# Altium schematic sheet Control.SchDoc
size A4; SheetNumber: 2; SheetTotal: 2
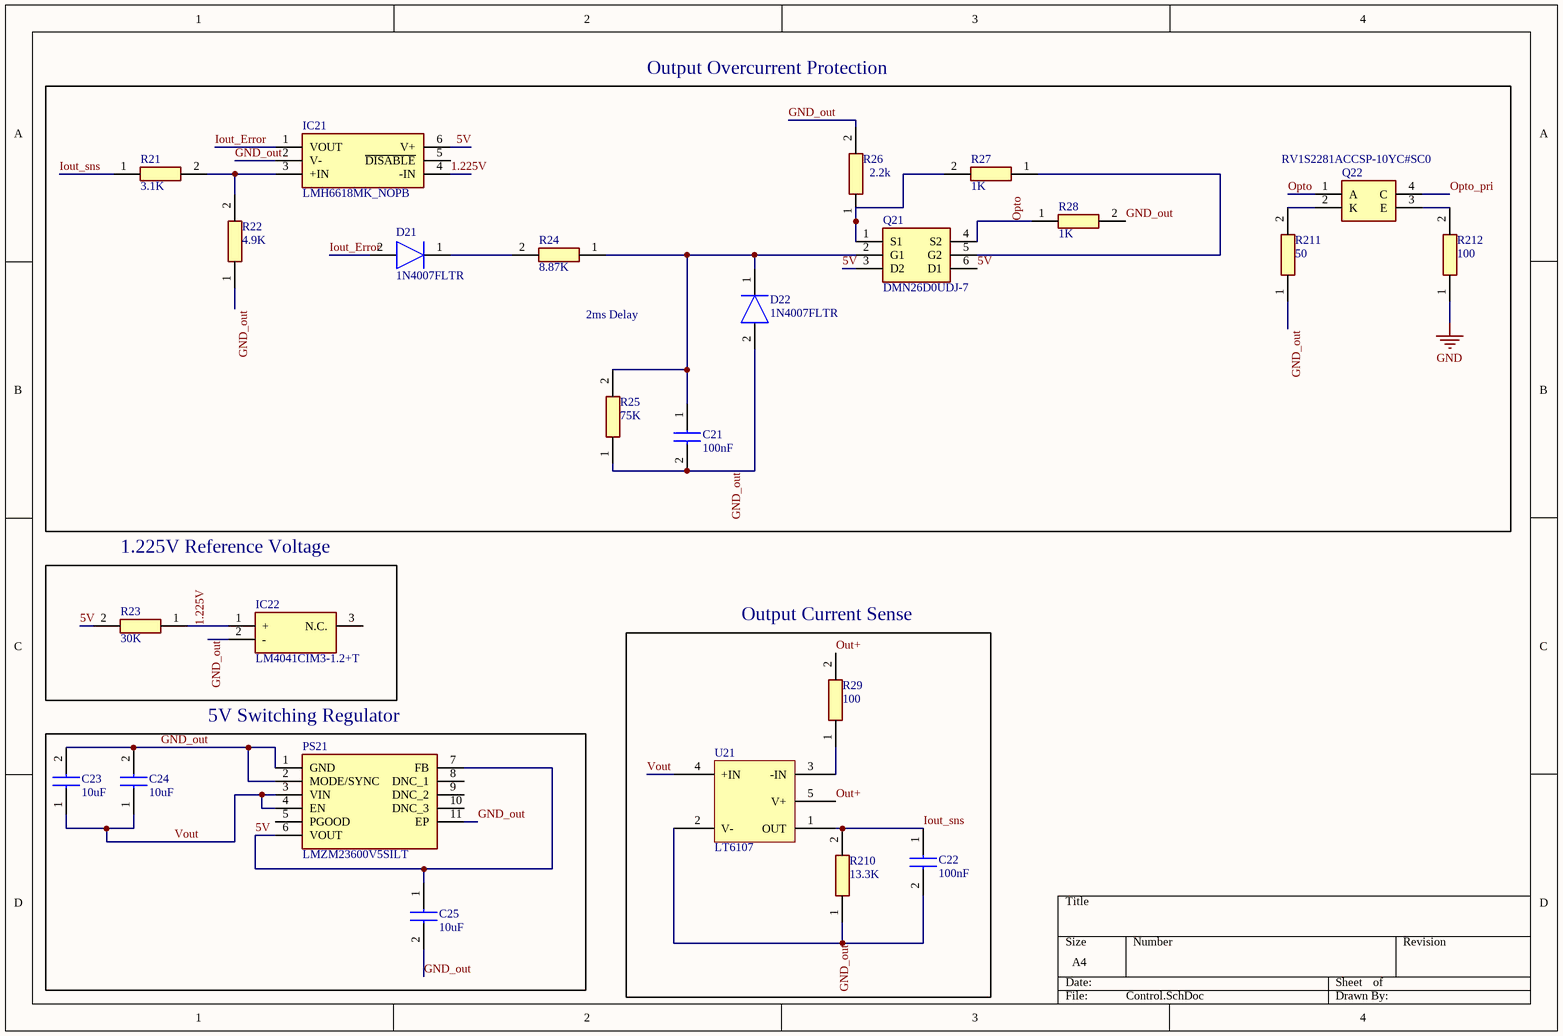
[diagram p0: Control.SchDoc]

## Parts
C21  100nF  [CAPC1005X55N]
C22  100nF  [CAPC1005X55N]
C23  10uF  [CAPC2012X145N]
C24  10uF  [CAPC2012X145N]
C25  10uF  [CAPC2012X145N]
D21  1N4007FLTR  [SODFL3718X140N]
D22  1N4007FLTR  [SODFL3718X140N]
IC21  LMH6618MK_NOPB  [SOT95P280X110-6N]
IC22  LM4041CIM3-1.2+T  [SOT95P237X112-3N]
PS21  LMZM23600V5SILT  [LMZM23600SILT]
Q21  DMN26D0UDJ-7  [SOTFL35P100X50-6N]
Q22  RV1S2281ACCSP-10YC#SC0  [SOP130P1020X210-4N]
R21  3.1K  [ERJ2RKD1004X]
R22  4.9K  [ERJ2RKD1004X]
R23  30K  [ERJ2RKD1004X]
R24  8.87K  [ERJ2RKD1004X]
R25  75K  [ERJ2RKD1004X]
R26  2.2k  [ERJ2RKD1004X]
R27  1K  [ERJ2RKD1004X]
R28  1K  [ERJ2RKD1004X]
R29  100  [ERJ2RKD1004X]
R210  13.3K  [ERJ2RKD1004X]
R211  50  [ERJ2RKD1004X]
R212  100  [ERJ2RKD1004X]
U21  LT6107  [SOT95P245X110-5N]

## Blocks framed on the sheet
Output Overcurrent Protection: C21 D21 D22 IC21 Q21 Q22 R21 R22 R24-R28 R211 R212
1.225V Reference Voltage: IC22 R23
Output Current Sense: C22 R29 R210 U21
5V Switching Regulator: C23-C25 PS21

## Nets
GND: R212.1
1.225V: IC21.4(-IN) IC22.1(+) R23.1
5V: C25.1 IC21.6(V+) PS21.6(VOUT) PS21.7(FB) Q21.3(D2) Q21.6(D1) R23.2
GND_out: C21.2 C22.2 C23.2 C24.2 C25.2 D22.2(A) IC21.2(V-) IC22.2(-) PS21.1(GND) PS21.2(MODE/SYNC) PS21.11(EP) R22.1 R25.1 R26.2 R28.2 R210.1 R211.1 U21.2(V-)
Iout_Error: D21.2(A) IC21.1(VOUT)
Iout_sns: C22.1 R21.1 R210.2 U21.1(OUT)
Opto: Q21.4(S2) Q22.1(A) R28.1
Opto_pri: Q22.4(C)
Out+: R29.2 U21.5(V+)
Vout: C23.1 C24.1 PS21.3(VIN) PS21.4(EN) U21.4(+IN)
NetC21_1: C21.1 D22.1(K) Q21.2(G1) R24.1 R25.2
NetD21_1: D21.1(K) R24.2
NetIC21_3: IC21.3(+IN) R21.2 R22.2
NetQ21_1: Q21.1(S1) R26.1 R27.2
NetQ21_5: Q21.5(G2) R27.1
NetQ22_2: Q22.2(K) R211.2
NetQ22_3: Q22.3(E) R212.2
NetR29_1: R29.1 U21.3(-IN)

Not connected (* = marked no-connect by the designer): IC21 5(~{DISABLE}); IC22 3(N.C.); PS21 5(PGOOD) 8(DNC_1) 9(DNC_2) 10(DNC_3)

## Notes on the sheet
- 2ms Delay

## Library data of the parts
C21 C22 = C0402C829D3GACTU: Capacitor; Manufacturer_Name: Kemet; Datasheet Link: https://content.kemet.com/datasheets/KEM_C1002_X7R_SMD.pdf; Height: 0.55mm; Manufacturer_Part_Number: C0402C829D3GACTU; Mouser Part Number: 80-C0402C829D3G; Mouser Price/Stock: https://www.mouser.co.uk/ProductDetail/KEMET/C0402C829D3GACTU?qs=ezuqA1hLDjkKgrGbHuNb0A%3D%3D; Arrow Part Number: C0402C829D3GACTU; Arrow Price/Stock: https://www.arrow.com/en/products/c0402c829d3gactu/kemet-corporation
C23-C25 = GCG21BR71H154KA01K: Capacitor; Manufacturer_Name: Murata Electronics; Datasheet Link: https://psearch.en.murata.com/capacitor/product/GCG21BR71H154KA01%23.html; Height: 1.45mm; Manufacturer_Part_Number: GCG21BR71H154KA01K; Mouser Part Number: 81-GCG21BR71H154KA1K; Mouser Price/Stock: https://www.mouser.co.uk/ProductDetail/Murata-Electronics/GCG21BR71H154KA01K?qs=QzBtWTOodeWaaJ9cJuc7Gg%3D%3D; Arrow Part Number: GCG21BR71H154KA01K; Arrow Price/Stock: https://www.arrow.com/en/products/gcg21br71h154ka01k/murata-manufacturing
D21 D22 = 1N4007FLTR: Diode; Manufacturer_Name: SMC; Datasheet Link: http://www.smc-diodes.com/propdf/1N4001FL-1N4007FL%20N1646%20REV.A.pdf; Height: 1.4mm; Manufacturer_Part_Number: 1N4007FLTR
IC21 = LMH6618MK_NOPB: Integrated Circuit; Manufacturer_Name: Texas Instruments; Manufacturer_Part_Number: LMH6618MK/NOPB; Datasheet Link: http://www.ti.com/lit/ds/symlink/lmh6618.pdf; Height: 1.1mm; Mouser Part Number: 926-LMH6618MK/NOPB; Mouser Price/Stock: https://www.mouser.co.uk/ProductDetail/Texas-Instruments/LMH6618MK-NOPB?qs=7lkVKPoqpbaHKIKeeUkpDw%3D%3D; Arrow Part Number: LMH6618MK/NOPB; Arrow Price/Stock: https://www.arrow.com/en/products/lmh6618mknopb/texas-instruments?region=nac
IC22 = LM4041CIM3-1.2+T: Integrated Circuit; Manufacturer_Name: Maxim Integrated; Datasheet Link: https://pdfserv.maximintegrated.com/en/ds/LM4041.pdf; Height: 1.12mm; Manufacturer_Part_Number: LM4041CIM3-1.2+T; Mouser Part Number: 700-LM4041CIM3-1.2T; Mouser Price/Stock: https://www.mouser.co.uk/ProductDetail/Maxim-Integrated/LM4041CIM3-12%2bT?qs=GxOUx7aO6nzSYD%252Bwc9k7xw%3D%3D
PS21 = LMZM23600V5SILT: Power Supply; Manufacturer_Name: Texas Instruments; Datasheet Link: https://componentsearchengine.com/Datasheets/2/LMZM23600V5SILT.pdf; Height: 1.578mm; Manufacturer_Part_Number: LMZM23600V5SILT; Mouser Part Number: 595-LMZM23600V5SILT; Mouser Price/Stock: https://www.mouser.co.uk/ProductDetail/Texas-Instruments/LMZM23600V5SILT?qs=55YtniHzbhCr0j8%2FvNPzJg%3D%3D; Arrow Part Number: LMZM23600V5SILT; Arrow Price/Stock: https://www.arrow.com/en/products/lmzm23600v5silt/texas-instruments?region=nac
Q21 = DMN26D0UDJ-7: MOSFET (N-Channel); Manufacturer_Name: Diodes Inc.; Datasheet Link: https://www.diodes.com/assets/Datasheets/ds31481.pdf; Height: 0.5mm; Manufacturer_Part_Number: DMN26D0UDJ-7; Mouser Part Number: 621-DMN26D0UDJ-7; Mouser Price/Stock: https://www.mouser.co.uk/ProductDetail/Diodes-Incorporated/DMN26D0UDJ-7?qs=VJbqQHImxEwYAK9Ioc59og%3D%3D; Arrow Part Number: DMN26D0UDJ-7; Arrow Price/Stock: https://www.arrow.com/en/products/dmn26d0udj-7/diodes-incorporated?region=nac
Q22 = RV1S2281ACCSP-10YC#SC0: Transistor; Manufacturer_Name: Renesas Electronics; Datasheet Link: https://www.renesas.com/in/en/doc/products/opt/r08ds0185ej0100-rv1s2281a.pdf; Height: 2.1mm; Manufacturer_Part_Number: RV1S2281ACCSP-10YC#SC0; Mouser Part Number: 968-2281ACCSP10YCSC0; Mouser Price/Stock: https://www.mouser.co.uk/ProductDetail/Renesas-Electronics/RV1S2281ACCSP-10YCSC0?qs=wnTfsH77Xs7B5%2FobUeyKWw%3D%3D
R21-R29 R210-R212 = ERJ2RKF4023X: Resistor; Manufacturer_Name: Panasonic; Datasheet Link: http://docs-europe.electrocomponents.com/webdocs/13ba/0900766b813ba21b.pdf; Height: 0.4mm; Manufacturer_Part_Number: ERJ2RKF4023X